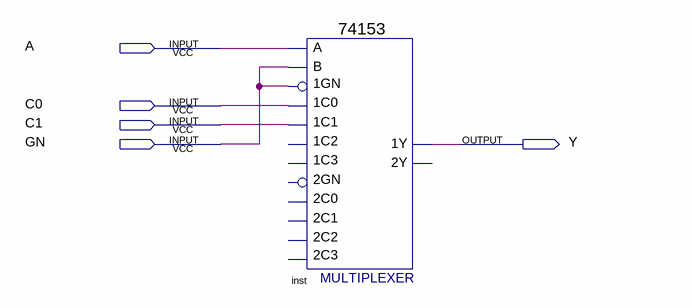
[diagram p0: schematic sheet]
// Quartus schematic SEL21.bdf as structural Verilog: 1 symbols, 5 pins
module SEL21 (
  input  A,
  input  C0,
  input  C1,
  input  GN,
  output Y
);

  \74153  inst (
    .\1C1 (C1), .\1GN (GN), .\1C0 (C0), .B(GN), .A(A), .\1Y (Y));  // open: 2C0, 2GN, 2C2, 1C2, 1C3, 2C1, 2C3, 2Y
endmodule
